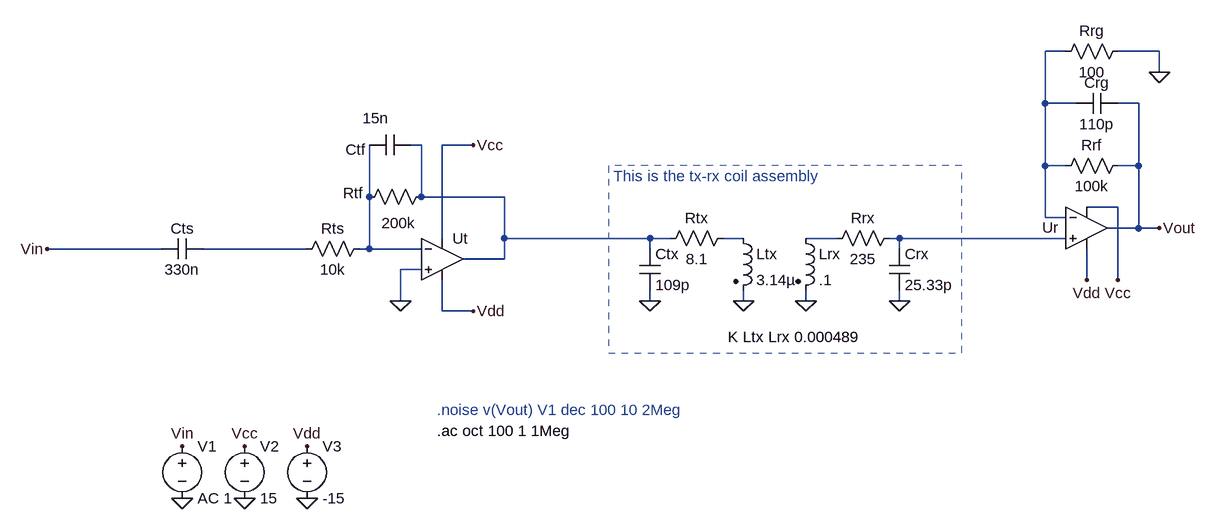
[diagram p0: schematic inverting-less-noice.asc]
inverting-less-noice.asc, the LTspice schematic file:
Version 4
SHEET 1 1552 680
WIRE 1264 -128 1232 -128
WIRE 1408 -128 1344 -128
WIRE 1408 -96 1408 -128
WIRE 1232 -48 1232 -128
WIRE 1280 -48 1232 -48
WIRE 1376 -48 1344 -48
WIRE 272 16 256 16
WIRE 352 16 304 16
WIRE 1232 48 1232 -48
WIRE 1264 48 1232 48
WIRE 1376 48 1376 -48
WIRE 1376 48 1344 48
WIRE 192 96 192 16
WIRE 272 96 272 16
WIRE 400 96 272 96
WIRE 1344 112 1296 112
WIRE 1232 128 1232 48
WIRE 1264 128 1232 128
WIRE 1376 144 1376 48
WIRE 1376 144 1328 144
WIRE 1408 144 1376 144
WIRE 304 160 304 16
WIRE 400 160 400 96
WIRE 624 160 400 160
WIRE 656 160 624 160
WIRE 768 160 736 160
WIRE 912 160 864 160
WIRE 1008 160 992 160
WIRE 1264 160 1008 160
WIRE -128 176 -304 176
WIRE 96 176 -64 176
WIRE 192 176 192 96
WIRE 192 176 176 176
WIRE 272 176 192 176
WIRE 624 176 624 160
WIRE 1008 176 1008 160
WIRE 400 192 400 160
WIRE 400 192 336 192
WIRE 272 208 240 208
WIRE 1296 224 1296 176
WIRE 1344 224 1344 112
WIRE 240 256 240 208
WIRE 624 256 624 240
WIRE 768 256 768 240
WIRE 864 256 864 240
WIRE 1008 256 1008 240
WIRE 304 272 304 224
WIRE 352 272 304 272
FLAG 96 560 0
FLAG 0 560 0
FLAG -96 560 0
FLAG -96 480 Vin
FLAG 0 480 Vcc
FLAG 96 480 Vdd
FLAG 352 272 Vdd
FLAG 352 16 Vcc
FLAG -304 176 Vin
FLAG 768 256 0
FLAG 864 256 0
FLAG 1008 256 0
FLAG 624 256 0
FLAG 240 256 0
FLAG 1408 144 Vout
FLAG 1296 224 Vdd
FLAG 1344 224 Vcc
FLAG 1408 -96 0
SYMBOL Opamps\\UniversalOpamp2 304 192 R0
SYMATTR InstName Ut
SYMBOL voltage -96 464 R0
SYMATTR InstName V1
SYMATTR Value AC 1
SYMBOL voltage 0 464 R0
SYMATTR InstName V2
SYMATTR Value 15
SYMBOL voltage 96 464 R0
SYMATTR InstName V3
SYMATTR Value -15
SYMBOL res 752 144 R90
WINDOW 0 0 56 VBottom 2
WINDOW 3 32 56 VTop 2
SYMATTR InstName Rtx
SYMATTR Value 8.1
SYMBOL ind2 752 144 R0
SYMATTR InstName Ltx
SYMATTR Value 3.14µ
SYMATTR Type ind
SYMBOL ind2 848 144 R0
SYMATTR InstName Lrx
SYMATTR Value .1
SYMATTR Type ind
SYMBOL res 1008 144 R90
WINDOW 0 0 56 VBottom 2
WINDOW 3 32 56 VTop 2
SYMATTR InstName Rrx
SYMATTR Value 235
SYMBOL cap 992 176 R0
SYMATTR InstName Crx
SYMATTR Value 25.33p
SYMBOL cap 608 176 R0
SYMATTR InstName Ctx
SYMATTR Value 109p
SYMBOL cap -64 160 R90
WINDOW 0 0 32 VBottom 2
WINDOW 3 32 32 VTop 2
SYMATTR InstName Cts
SYMATTR Value 330n
SYMBOL res 192 160 R90
WINDOW 0 0 56 VBottom 2
WINDOW 3 32 56 VTop 2
SYMATTR InstName Rts
SYMATTR Value 10k
SYMBOL res 176 112 R270
WINDOW 0 6 -9 VTop 2
WINDOW 3 -9 61 VBottom 2
SYMATTR InstName Rtf
SYMATTR Value 200k
SYMBOL cap 256 0 R90
WINDOW 0 39 85 VBottom 2
WINDOW 3 -41 54 VTop 2
SYMATTR InstName Ctf
SYMATTR Value 15n
SYMBOL Opamps\\UniversalOpamp2 1296 144 R0
WINDOW 0 -68 -1 Left 2
SYMATTR InstName Ur
SYMBOL res 1360 32 R90
WINDOW 0 0 56 VBottom 2
WINDOW 3 32 56 VTop 2
SYMATTR InstName Rrf
SYMATTR Value 100k
SYMBOL res 1248 -112 R270
WINDOW 0 32 56 VTop 2
WINDOW 3 0 56 VBottom 2
SYMATTR InstName Rrg
SYMATTR Value 100
SYMBOL cap 1280 -32 R270
WINDOW 0 32 32 VTop 2
WINDOW 3 0 32 VBottom 2
SYMATTR InstName Crg
SYMATTR Value 110p
TEXT 744 312 Left 2 !K Ltx Lrx 0.000489
TEXT 568 64 Left 2 ;This is the tx-rx coil assembly
TEXT 296 456 Left 2 !.ac oct 100 1 1Meg
TEXT 296 424 Left 2 ;.noise v(Vout) V1 dec 100 10 2Meg
RECTANGLE Normal 1104 48 560 336 4

The netlist it stands for:
* inverting-less-noice.asc
XUt 0 N003 Vcc Vdd N002 level.2 Avol=1Meg GBW=10Meg Slew=10Meg ilimit=25m rail=0 Vos=0 phimargin=45 en=0 enk=0 in=0 ink=0 Rin=500Meg  ; pins IN+ IN- V+ V- OUT
V1 Vin 0 AC 1
V2 Vcc 0 15
V3 Vdd 0 -15
Rtx N004 N002 8.1
Ltx N004 0 3.14µ
Lrx N005 0 .1
Rrx N006 N005 235
Crx N006 0 25.33p
Ctx N002 0 109p
Cts N007 Vin 330n
Rts N003 N007 10k
Rtf N003 N002 200k
Ctf N002 N003 15n
XUr N006 N001 Vcc Vdd Vout level.2 Avol=1Meg GBW=10Meg Slew=10Meg ilimit=25m rail=0 Vos=0 phimargin=45 en=0 enk=0 in=0 ink=0 Rin=500Meg  ; pins IN+ IN- V+ V- OUT
Rrf Vout N001 100k
Rrg N001 0 100
Crg N001 Vout 110p
K Ltx Lrx 0.000489
* This is the tx-rx coil assembly
.ac oct 100 1 1Meg
* .noise v(Vout) V1 dec 100 10 2Meg
.lib UniversalOpamps2.sub
.backanno
.end